# Altium project RFC_MB.PrjPcb (part 2 of 7)

## Sheet cyc_v_som_C.SchDoc
size A3
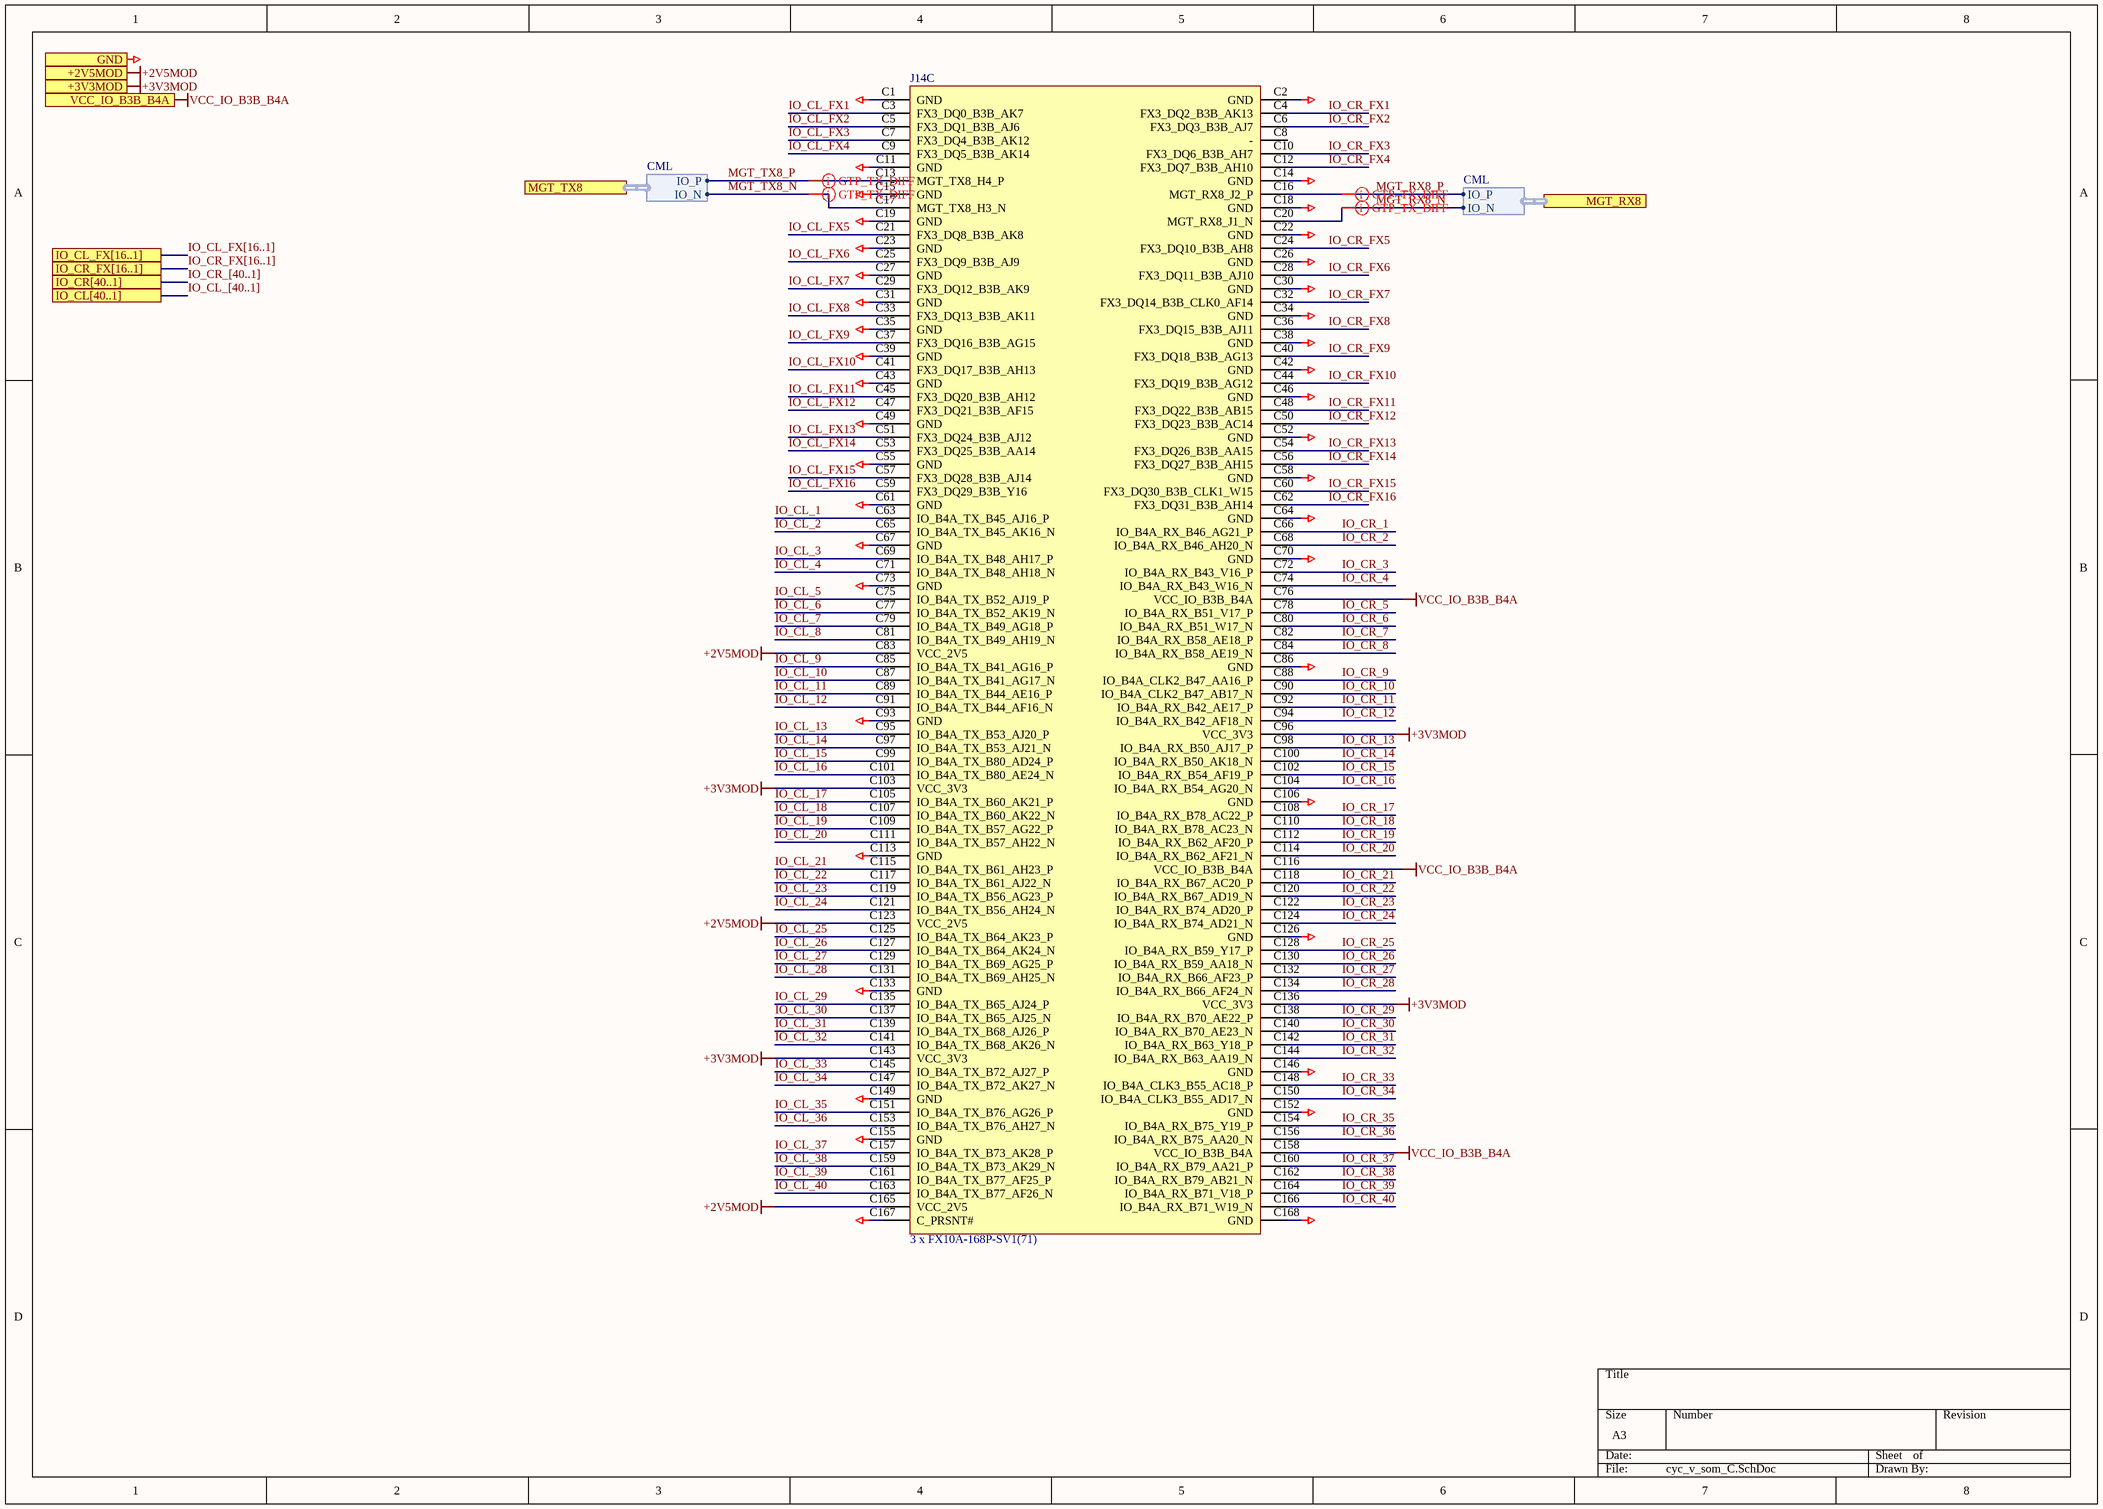
[diagram p3: cyc_v_som_C.SchDoc]

### Parts
J14  3 x FX10A-168P-SV1(71)  [Mercury_SA2p]  (part C of 4)

### Ports
+2V5MOD, +3V3MOD, GND, IO_CL[40..1], IO_CL_FX[16..1], IO_CR[40..1], IO_CR_FX[16..1], MGT_RX8 (harness CML), MGT_TX8 (harness CML), VCC_IO_B3B_B4A

### Harnesses
CML: IO_N, IO_P

### Nets
+2V5MOD: J14.C76(VCC_IO_B3B_B4A) J14.C83(VCC_2V5) J14.C116(VCC_IO_B3B_B4A) J14.C123(VCC_2V5) J14.C158(VCC_IO_B3B_B4A) J14.C165(VCC_2V5) ; port +2V5MOD, port VCC_IO_B3B_B4A  [also labelled VCC_IO_B3B_B4A]
+3V3MOD: J14.C96(VCC_3V3) J14.C103(VCC_3V3) J14.C136(VCC_3V3) J14.C143(VCC_3V3) ; port +3V3MOD
GND: J14.C1(GND) J14.C2(GND) J14.C11(GND) J14.C14(GND) J14.C15(GND) J14.C18(GND) J14.C19(GND) J14.C22(GND) J14.C23(GND) J14.C26(GND) J14.C27(GND) J14.C30(GND) J14.C31(GND) J14.C34(GND) J14.C35(GND) J14.C38(GND) J14.C39(GND) J14.C42(GND) J14.C43(GND) J14.C46(GND) J14.C49(GND) J14.C52(GND) J14.C55(GND) J14.C58(GND) J14.C61(GND) J14.C64(GND) J14.C67(GND) J14.C70(GND) J14.C73(GND) J14.C86(GND) J14.C93(GND) J14.C106(GND) J14.C113(GND) J14.C126(GND) J14.C133(GND) J14.C146(GND) J14.C149(GND) J14.C152(GND) J14.C155(GND) J14.C167(C_PRSNT#) J14.C168(GND) ; port GND
IO_CL_1: J14.C63(IO_B4A_TX_B45_AJ16_P)  [project net IO_CL1]
IO_CL_2: J14.C65(IO_B4A_TX_B45_AK16_N)  [project net IO_CL2]
IO_CL_3: J14.C69(IO_B4A_TX_B48_AH17_P)  [project net IO_CL3]
IO_CL_4: J14.C71(IO_B4A_TX_B48_AH18_N)  [project net IO_CL4]
IO_CL_5: J14.C75(IO_B4A_TX_B52_AJ19_P)  [project net IO_CL5]
IO_CL_6: J14.C77(IO_B4A_TX_B52_AK19_N)  [project net IO_CL6]
IO_CL_7: J14.C79(IO_B4A_TX_B49_AG18_P)  [project net IO_CL7]
IO_CL_8: J14.C81(IO_B4A_TX_B49_AH19_N)  [project net IO_CL8]
IO_CL_9: J14.C85(IO_B4A_TX_B41_AG16_P)  [project net IO_CL9]
IO_CL_10: J14.C87(IO_B4A_TX_B41_AG17_N)  [project net IO_CL10]
IO_CL_11: J14.C89(IO_B4A_TX_B44_AE16_P)  [project net IO_CL11]
IO_CL_12: J14.C91(IO_B4A_TX_B44_AF16_N)  [project net IO_CL12]
IO_CL_13: J14.C95(IO_B4A_TX_B53_AJ20_P)  [project net IO_CL13]
IO_CL_14: J14.C97(IO_B4A_TX_B53_AJ21_N)  [project net IO_CL14]
IO_CL_15: J14.C99(IO_B4A_TX_B80_AD24_P)  [project net IO_CL15]
IO_CL_16: J14.C101(IO_B4A_TX_B80_AE24_N)  [project net IO_CL16]
IO_CL_17: J14.C105(IO_B4A_TX_B60_AK21_P)  [project net IO_CL17]
IO_CL_18: J14.C107(IO_B4A_TX_B60_AK22_N)  [project net IO_CL18]
IO_CL_19: J14.C109(IO_B4A_TX_B57_AG22_P)  [project net IO_CL19]
IO_CL_20: J14.C111(IO_B4A_TX_B57_AH22_N)  [project net IO_CL20]
IO_CL_21: J14.C115(IO_B4A_TX_B61_AH23_P)  [project net IO_CL21]
IO_CL_22: J14.C117(IO_B4A_TX_B61_AJ22_N)  [project net IO_CL22]
IO_CL_23: J14.C119(IO_B4A_TX_B56_AG23_P)  [project net IO_CL23]
IO_CL_24: J14.C121(IO_B4A_TX_B56_AH24_N)  [project net IO_CL24]
IO_CL_25: J14.C125(IO_B4A_TX_B64_AK23_P)  [project net IO_CL25]
IO_CL_26: J14.C127(IO_B4A_TX_B64_AK24_N)  [project net IO_CL26]
IO_CL_27: J14.C129(IO_B4A_TX_B69_AG25_P)  [project net IO_CL27]
IO_CL_28: J14.C131(IO_B4A_TX_B69_AH25_N)  [project net IO_CL28]
IO_CL_29: J14.C135(IO_B4A_TX_B65_AJ24_P)  [project net IO_CL29]
IO_CL_30: J14.C137(IO_B4A_TX_B65_AJ25_N)  [project net IO_CL30]
IO_CL_31: J14.C139(IO_B4A_TX_B68_AJ26_P)  [project net IO_CL31]
IO_CL_32: J14.C141(IO_B4A_TX_B68_AK26_N)  [project net IO_CL32]
IO_CL_33: J14.C145(IO_B4A_TX_B72_AJ27_P)  [project net IO_CL33]
IO_CL_34: J14.C147(IO_B4A_TX_B72_AK27_N)  [project net IO_CL34]
IO_CL_35: J14.C151(IO_B4A_TX_B76_AG26_P)  [project net IO_CL35]
IO_CL_36: J14.C153(IO_B4A_TX_B76_AH27_N)  [project net IO_CL36]
IO_CL_37: J14.C157(IO_B4A_TX_B73_AK28_P)  [project net IO_CL37]
IO_CL_38: J14.C159(IO_B4A_TX_B73_AK29_N)  [project net IO_CL38]
IO_CL_39: J14.C161(IO_B4A_TX_B77_AF25_P)  [project net FCKO_P]
IO_CL_40: J14.C163(IO_B4A_TX_B77_AF26_N)  [project net FCKO_N]
IO_CL_FX1: J14.C3(FX3_DQ0_B3B_AK7)
IO_CL_FX2: J14.C5(FX3_DQ1_B3B_AJ6)
IO_CL_FX3: J14.C7(FX3_DQ4_B3B_AK12)
IO_CL_FX4: J14.C9(FX3_DQ5_B3B_AK14)
IO_CL_FX5: J14.C21(FX3_DQ8_B3B_AK8)
IO_CL_FX6: J14.C25(FX3_DQ9_B3B_AJ9)
IO_CL_FX7: J14.C29(FX3_DQ12_B3B_AK9)
IO_CL_FX8: J14.C33(FX3_DQ13_B3B_AK11)
IO_CL_FX9: J14.C37(FX3_DQ16_B3B_AG15)
IO_CL_FX10: J14.C41(FX3_DQ17_B3B_AH13)
IO_CL_FX11: J14.C45(FX3_DQ20_B3B_AH12)
IO_CL_FX12: J14.C47(FX3_DQ21_B3B_AF15)
IO_CL_FX13: J14.C51(FX3_DQ24_B3B_AJ12)
IO_CL_FX14: J14.C53(FX3_DQ25_B3B_AA14)
IO_CL_FX15: J14.C57(FX3_DQ28_B3B_AJ14)
IO_CL_FX16: J14.C59(FX3_DQ29_B3B_Y16)
IO_CR_1: J14.C66(IO_B4A_RX_B46_AG21_P)  [project net IO_CR1]
IO_CR_2: J14.C68(IO_B4A_RX_B46_AH20_N)  [project net IO_CR2]
IO_CR_3: J14.C72(IO_B4A_RX_B43_V16_P)  [project net IO_CR3]
IO_CR_4: J14.C74(IO_B4A_RX_B43_W16_N)  [project net IO_CR4]
IO_CR_5: J14.C78(IO_B4A_RX_B51_V17_P)  [project net IO_CR5]
IO_CR_6: J14.C80(IO_B4A_RX_B51_W17_N)  [project net IO_CR6]
IO_CR_7: J14.C82(IO_B4A_RX_B58_AE18_P)  [project net IO_CR7]
IO_CR_8: J14.C84(IO_B4A_RX_B58_AE19_N)  [project net IO_CR8]
IO_CR_9: J14.C88(IO_B4A_CLK2_B47_AA16_P)  [project net IO_CR9]
IO_CR_10: J14.C90(IO_B4A_CLK2_B47_AB17_N)  [project net IO_CR10]
IO_CR_11: J14.C92(IO_B4A_RX_B42_AE17_P)  [project net IO_CR11]
IO_CR_12: J14.C94(IO_B4A_RX_B42_AF18_N)  [project net IO_CR12]
IO_CR_13: J14.C98(IO_B4A_RX_B50_AJ17_P)  [project net IO_CR13]
IO_CR_14: J14.C100(IO_B4A_RX_B50_AK18_N)  [project net IO_CR14]
IO_CR_15: J14.C102(IO_B4A_RX_B54_AF19_P)  [project net IO_CR15]
IO_CR_16: J14.C104(IO_B4A_RX_B54_AG20_N)  [project net IO_CR16]
IO_CR_17: J14.C108(IO_B4A_RX_B78_AC22_P)  [project net IO_CR17]
IO_CR_18: J14.C110(IO_B4A_RX_B78_AC23_N)  [project net IO_CR18]
IO_CR_19: J14.C112(IO_B4A_RX_B62_AF20_P)  [project net IO_CR19]
IO_CR_20: J14.C114(IO_B4A_RX_B62_AF21_N)  [project net IO_CR20]
IO_CR_21: J14.C118(IO_B4A_RX_B67_AC20_P)  [project net IO_CR21]
IO_CR_22: J14.C120(IO_B4A_RX_B67_AD19_N)  [project net IO_CR22]
IO_CR_23: J14.C122(IO_B4A_RX_B74_AD20_P)  [project net IO_CR23]
IO_CR_24: J14.C124(IO_B4A_RX_B74_AD21_N)  [project net IO_CR24]
IO_CR_25: J14.C128(IO_B4A_RX_B59_Y17_P)  [project net IO_CR25]
IO_CR_26: J14.C130(IO_B4A_RX_B59_AA18_N)  [project net IO_CR26]
IO_CR_27: J14.C132(IO_B4A_RX_B66_AF23_P)  [project net IO_CR27]
IO_CR_28: J14.C134(IO_B4A_RX_B66_AF24_N)  [project net IO_CR28]
IO_CR_29: J14.C138(IO_B4A_RX_B70_AE22_P)  [project net IO_CR29]
IO_CR_30: J14.C140(IO_B4A_RX_B70_AE23_N)  [project net IO_CR30]
IO_CR_31: J14.C142(IO_B4A_RX_B63_Y18_P)  [project net IO_CR31]
IO_CR_32: J14.C144(IO_B4A_RX_B63_AA19_N)  [project net IO_CR32]
IO_CR_33: J14.C148(IO_B4A_CLK3_B55_AC18_P)  [project net IO_CR33]
IO_CR_34: J14.C150(IO_B4A_CLK3_B55_AD17_N)  [project net IO_CR34]
IO_CR_35: J14.C154(IO_B4A_RX_B75_Y19_P)  [project net IO_CR35]
IO_CR_36: J14.C156(IO_B4A_RX_B75_AA20_N)  [project net IO_CR36]
IO_CR_37: J14.C160(IO_B4A_RX_B79_AA21_P)  [project net IO_CR37]
IO_CR_38: J14.C162(IO_B4A_RX_B79_AB21_N)  [project net IO_CR38]
IO_CR_39: J14.C164(IO_B4A_RX_B71_V18_P)  [project net IO_CR39]
IO_CR_40: J14.C166(IO_B4A_RX_B71_W19_N)  [project net IO_CR40]
IO_CR_FX1: J14.C4(FX3_DQ2_B3B_AK13)
IO_CR_FX2: J14.C6(FX3_DQ3_B3B_AJ7)
IO_CR_FX3: J14.C10(FX3_DQ6_B3B_AH7)
IO_CR_FX4: J14.C12(FX3_DQ7_B3B_AH10)
IO_CR_FX5: J14.C24(FX3_DQ10_B3B_AH8)
IO_CR_FX6: J14.C28(FX3_DQ11_B3B_AJ10)
IO_CR_FX7: J14.C32(FX3_DQ14_B3B_CLK0_AF14)
IO_CR_FX8: J14.C36(FX3_DQ15_B3B_AJ11)
IO_CR_FX9: J14.C40(FX3_DQ18_B3B_AG13)
IO_CR_FX10: J14.C44(FX3_DQ19_B3B_AG12)
IO_CR_FX11: J14.C48(FX3_DQ22_B3B_AB15)
IO_CR_FX12: J14.C50(FX3_DQ23_B3B_AC14)
IO_CR_FX13: J14.C54(FX3_DQ26_B3B_AA15)
IO_CR_FX14: J14.C56(FX3_DQ27_B3B_AH15)
IO_CR_FX15: J14.C60(FX3_DQ30_B3B_CLK1_W15)
IO_CR_FX16: J14.C62(FX3_DQ31_B3B_AH14)
MGT_RX8_N: J14.C20(MGT_RX8_J1_N) ; port MGT_RX8.IO_N  [project net MGT_RX8.IO_N]
MGT_RX8_P: J14.C16(MGT_RX8_J2_P) ; port MGT_RX8.IO_P  [project net MGT_RX8.IO_P]
MGT_TX8_N: J14.C17(MGT_TX8_H3_N) ; port MGT_TX8.IO_N  [project net MGT_TX8.IO_N]
MGT_TX8_P: J14.C13(MGT_TX8_H4_P) ; port MGT_TX8.IO_P  [project net MGT_TX8.IO_P]

Not connected (* = marked no-connect by the designer): J14 C8(-)

### Buses and harness runs
bus IO_CL_[40..1] = port IO_CL[40..1]
bus IO_CL_FX[16..1] = port IO_CL_FX[16..1]
bus IO_CR_[40..1] = port IO_CR[40..1]
bus IO_CR_FX[16..1] = port IO_CR_FX[16..1]

### Layout directives
differential pair; rule Differential Pairs Routing [Pref Gap = 0.175mm    Min Gap  = 0.075mm    Max Gap  = 0.5mmPref Width = 0.25mm    Min Width  = 0.075mm    Max Width  = 0.5mm]: MGT_RX8.IO_N, MGT_RX8.IO_P, MGT_TX8.IO_N, MGT_TX8.IO_P

### Library data of the parts
J14 = FX10A-168P-SV_ME-SA2+: as J14 on sheet cyc_v_som_A; HelpURL: https://www.hirose.com/product/document?clcode=CL0570-0044-8-71&productname=FX10A-168P-SV(71)&series=FX10&documenttype=Catalog&lang=ru&documentid=D31650_en; PartField: FX10A-168P-SV1(71); Value: 3 x FX10A-168P-SV1(71); THD Solders: 0